# Altium schematic sheet SDP_loadcell.SchDoc
size A2; SheetNumber: 1; SheetTotal: 1
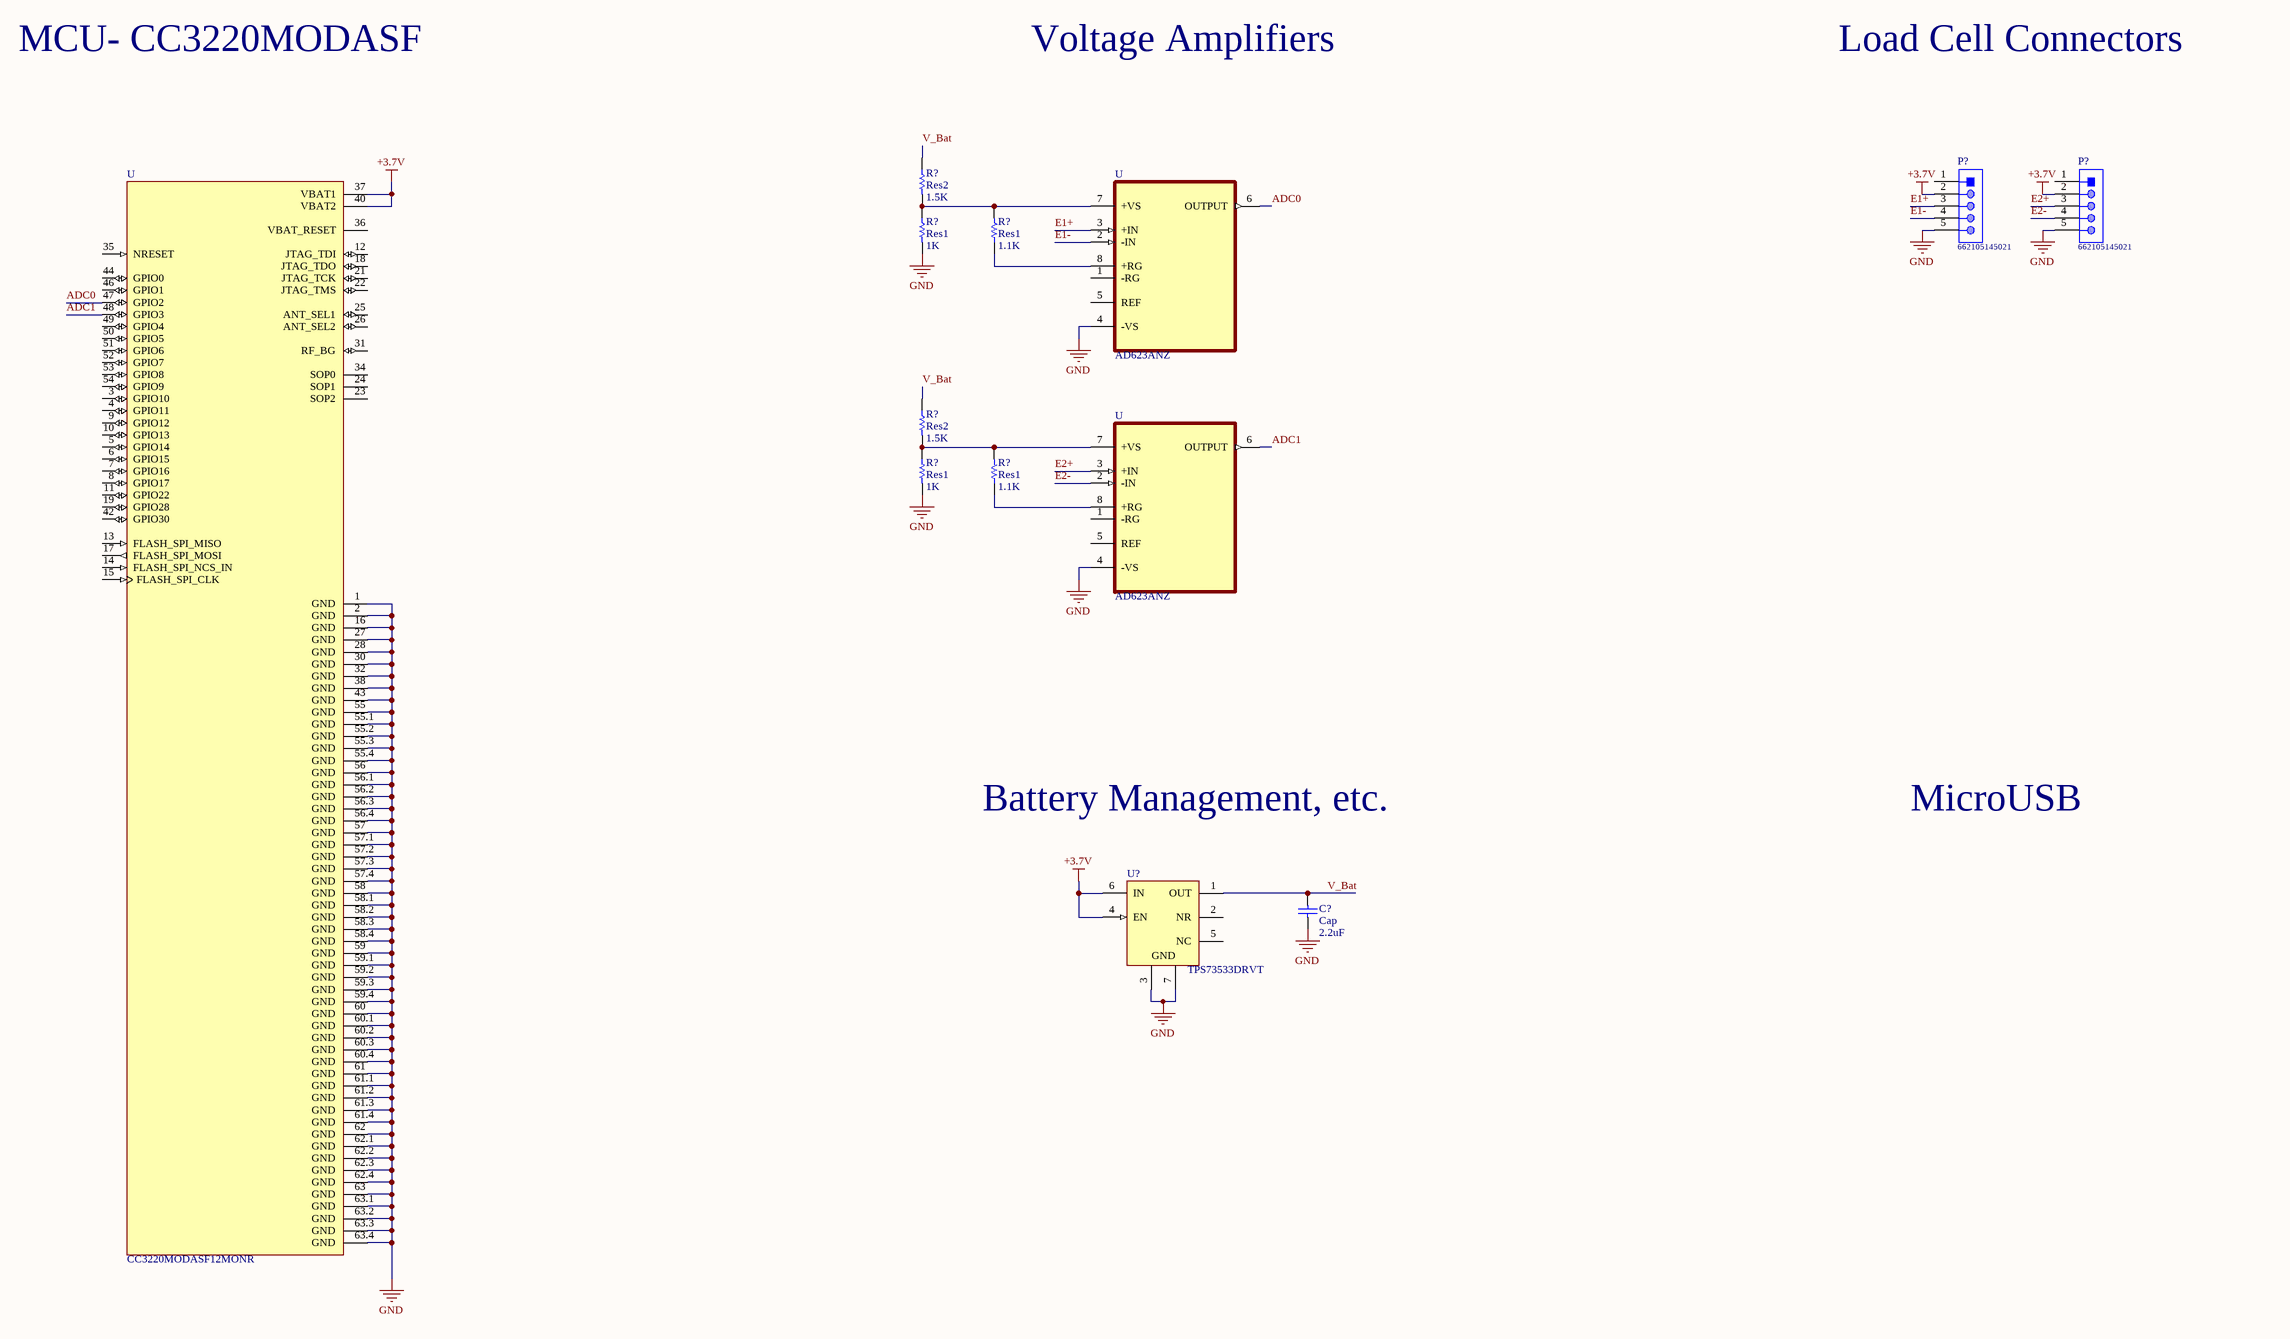
[diagram p0: SDP_loadcell.SchDoc]

## Parts
(Parts that share a designator on the sheet are numbered #1, #2 ... from top to bottom, then left to right.)
C?  Cap  value 2.2uF  [RAD-0.3]
P?#1  662105145021  [662105145021]
P?#2  662105145021  [662105145021]
R?#1  Res2  value 1.5K  [AXIAL-0.3]
R?#2  Res1  value 1K  [AXIAL-0.3]
R?#3  Res1  value 1.1K  [AXIAL-0.3]
R?#4  Res2  value 1.5K  [AXIAL-0.3]
R?#5  Res1  value 1K  [AXIAL-0.3]
R?#6  Res1  value 1.1K  [AXIAL-0.3]
U#1  AD623ANZ  [DIP254P762X533-8]
U#2  CC3220MODASF12MONR  [XCVR_CC3220MODASF12MONR]
U#3  AD623ANZ  [DIP254P762X533-8]
U?  TPS73533DRVT  [DRV0006A_V]

## Nets
+3.7V: P?#1.2 P?#2.2 U#2.37(VBAT1) U#2.40(VBAT2) U?.4(EN) U?.6(IN)
GND: C?.1 P?#1.5 P?#2.5 R?#2.2 R?#5.2 U#1.4(-VS) U#2.1(GND) U#2.2(GND) U#2.16(GND) U#2.27(GND) U#2.28(GND) U#2.30(GND) U#2.32(GND) U#2.38(GND) U#2.43(GND) U#2.55(GND) U#2.55.1(GND) U#2.55.2(GND) U#2.55.3(GND) U#2.55.4(GND) U#2.56(GND) U#2.56.1(GND) U#2.56.2(GND) U#2.56.3(GND) U#2.56.4(GND) U#2.57(GND) U#2.57.1(GND) U#2.57.2(GND) U#2.57.3(GND) U#2.57.4(GND) U#2.58(GND) U#2.58.1(GND) U#2.58.2(GND) U#2.58.3(GND) U#2.58.4(GND) U#2.59(GND) U#2.59.1(GND) U#2.59.2(GND) U#2.59.3(GND) U#2.59.4(GND) U#2.60(GND) U#2.60.1(GND) U#2.60.2(GND) U#2.60.3(GND) U#2.60.4(GND) U#2.61(GND) U#2.61.1(GND) U#2.61.2(GND) U#2.61.3(GND) U#2.61.4(GND) U#2.62(GND) U#2.62.1(GND) U#2.62.2(GND) U#2.62.3(GND) U#2.62.4(GND) U#2.63(GND) U#2.63.1(GND) U#2.63.2(GND) U#2.63.3(GND) U#2.63.4(GND) U#3.4(-VS) U?.3(GND) U?.7(GND)
ADC0: U#1.6(OUTPUT) U#2.47(GPIO2)
ADC1: U#2.48(GPIO3) U#3.6(OUTPUT)
E1+: P?#1.3 U#1.3(+IN)
E1-: P?#1.4 U#1.2(-IN)
E2+: P?#2.3 U#3.3(+IN)
E2-: P?#2.4 U#3.2(-IN)
V_Bat: C?.2 R?#1.1 R?#4.1 U?.1(OUT)
NetR?#1_2: R?#1.2 R?#2.1 R?#3.2 U#1.7(+VS)
NetR?#3_1: R?#3.1 U#1.8(+RG)
NetR?#4_2: R?#4.2 R?#5.1 R?#6.2 U#3.7(+VS)
NetR?#6_1: R?#6.1 U#3.8(+RG)

Not connected (* = marked no-connect by the designer): P?#1 1; P?#2 1; U#1 1(-RG) 5(REF); U#2 3(GPIO10) 4(GPIO11) 5(GPIO14) 6(GPIO15) 7(GPIO16) 8(GPIO17) 9(GPIO12) 10(GPIO13) 11(GPIO22) 12(JTAG_TDI) 13(FLASH_SPI_MISO) 14(FLASH_SPI_NCS_IN) 15(FLASH_SPI_CLK) 17(FLASH_SPI_MOSI) 18(JTAG_TDO) 19(GPIO28) 21(JTAG_TCK) 22(JTAG_TMS) 23(SOP2) 24(SOP1) 25(ANT_SEL1) 26(ANT_SEL2) 31(RF_BG) 34(SOP0) 35(NRESET) 36(VBAT_RESET) 42(GPIO30) 44(GPIO0) 46(GPIO1) 49(GPIO4) 50(GPIO5) 51(GPIO6) 52(GPIO7) 53(GPIO8) 54(GPIO9); U#3 1(-RG) 5(REF); U? 2(NR) 5(NC)

## Notes on the sheet
- MCU- CC3220MODASF
- Voltage Amplifiers
- Load Cell Connectors
- Battery Management, etc.
- MicroUSB

## Library data of the parts
C? = Cap: Capacitor; Published: 8-Jun-2000; LatestRevisionDate: 17-Jul-2002; LatestRevisionNote: Re-released for DXP Platform.; PackageReference: RAD-0.3; Publisher: Altium Limited; PackageDescription: Radial Cap, Thru-Hole; 2 Leads; 0.3 in Pin Spacing
P?#1 P?#2 = CMP-1502-00485-1: SMT Male Header WR-MPC3, with SMT Solder Tabs, Right Angled, Single Row, pitch 3 mm, 5 pins; Manufacturer: Wurth Elektronik; Working Voltage: 250VAC; Pin Number: 5; Contact Resistance: 10mOhm; Pitch: 3mm; Part Number: 662105145021; Mounting Technology: SMT; Publisher: WurthElektronik; Packaging: TapeandReel; Datasheet URL: https://katalog.we-online.de/em/datasheet/6621xx145021.pdf; Package Reference: 662105145021; Operating Temperature: -40to105degC; Gender: Male; Manufacturer URL: http://www.we-online.de; Orientation: RightAngled
R?#1-R?#6 = Res1: Resistor; Published: 8-Jun-2000; LatestRevisionDate: 17-Jul-2002; LatestRevisionNote: Re-released for DXP Platform.; PackageReference: AXIAL-0.3; Publisher: Altium Limited; PackageDescription: Axial Device, Thru-Hole; 2 Leads; 0.3 in Pin Spacing
U#1 U#3 = AD623ANZ: Instrumentation Amplifier 1 Circuit Rail-to-Rail 8-PDIP; MF: Analog Devices; Price: None; Value: *; SnapEDA_Link: https://www.snapeda.com/parts/AD623ANZ/Analog%20Devices%20Inc./view-part/9794/?ref=snap; Mouser-Purchase-URL: https://snapeda.com/shop?store=Mouser&id=9794; Package: PDIP-8 Analog Devices; Arrow_Electronics-Purchase-URL: https://snapeda.com/shop?store=Arrow+Electronics&id=9794; Availability: Good; MP: AD623ANZ; DigiKey-Purchase-URL: https://snapeda.com/shop?store=DigiKey&id=9794
U#2 = CC3220MODASF12MONR: IC RF TxRx + MCU WiFi 802.11b/g/n 2.4GHz 63-SMD Module; MF: Texas Instruments; Value: *; MP: CC3220MODASF12MONR; SnapEDA_Link: https://www.snapeda.com/parts/CC3220MODASF12MONR/Texas%20Instruments/view-part/1581700/?ref=snap; Availability: Unavailable; Price: None; Package: SMD-63 Texas Instruments
U? = CMP-0395-00672-2: Single Output High PSRR LDO, 500 mA, Fixed 3.3 V Output, 2.7 to 6.5 V Input, with Low IQ, 6-pin SON (DRV), -40 to 125 degC, Green (RoHS & no Sb/Br); Manufacturer: Texas Instruments; Iout(Max)(A): 0.5; Vin(Max)(V): 6.5; Vin(Min)(V): 2.7; SubFamily: Single Channel LDO; Fixed Output Options(V): 3.3; Accuracy(%): 2; Vdo(Typ)(mV): 280; Iq(Typ)(mA): 0.04; ComponentLink3URL: http://www.ti.com/litv/pdf/mpds216d; PartNumber: TPS73533DRVT; ComponentLink2Description: Datasheet; DatasheetVersion: SBVS087J; ComponentLink3Description: Package Specification; Vout Adj(Min)(V): 3.3; Eco-Plan: Green (RoHS & no Sb/Br); ComponentLink1URL: http://www.ti.com/; Vout Adj(Max)(V): 3.3; PackageDescription: 6-Pin Plastic Small Outline No-Lead, Body 2 x 2 mm, Pitch 0.65 mm; ComponentLink2URL: http://www.ti.com/general/docs/lit/getliterature.tsp?genericPartNumber=TPS73533&fileType=pdf; PackageVersion: 4206925/E; Mounting Technology: Surface Mount; PackageReference: DRV0006A; ComponentLink1Description: Manufacturer URL